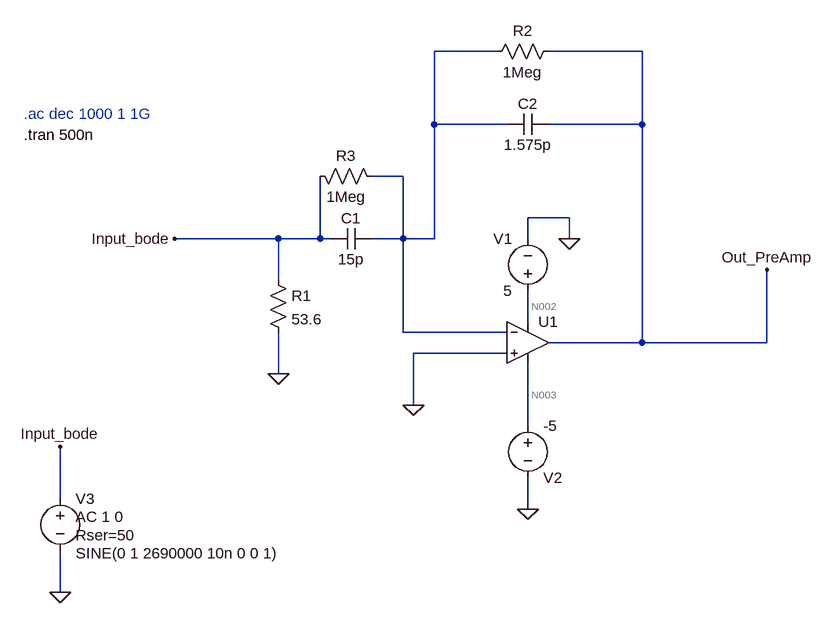
[diagram p0: schematic preamp_v2.asc]
preamp_v2.asc, the LTspice schematic file:
Version 4
SHEET 1 888 796
WIRE 400 -128 304 -128
WIRE 624 -128 480 -128
WIRE 304 -16 304 -128
WIRE 416 -16 304 -16
WIRE 624 -16 624 -128
WIRE 624 -16 480 -16
WIRE 256 64 208 64
WIRE 512 128 448 128
WIRE 64 160 -96 160
WIRE 128 160 128 64
WIRE 128 160 64 160
WIRE 144 160 128 160
WIRE 256 160 256 64
WIRE 256 160 208 160
WIRE 304 160 304 -16
WIRE 304 160 256 160
WIRE 448 160 448 128
WIRE 512 160 512 128
WIRE 64 224 64 160
WIRE 448 288 448 240
WIRE 256 304 256 160
WIRE 416 304 256 304
WIRE 624 320 624 -16
WIRE 624 320 480 320
WIRE 816 320 816 208
WIRE 816 320 624 320
WIRE 416 336 272 336
WIRE 64 368 64 304
WIRE 272 416 272 336
WIRE 448 448 448 352
WIRE -272 560 -272 480
WIRE 448 576 448 528
WIRE -272 704 -272 640
FLAG -272 704 0
FLAG -272 480 Input_bode
FLAG 448 576 0
FLAG 512 160 0
FLAG 272 416 0
FLAG 816 208 Out_PreAmp
FLAG -96 160 Input_bode
FLAG 64 368 0
SYMBOL voltage 448 256 R180
WINDOW 0 24 96 Left 2
WINDOW 3 24 16 Left 2
WINDOW 123 0 0 Left 0
WINDOW 39 0 0 Left 0
SYMATTR InstName V1
SYMATTR Value 5
SYMBOL voltage 448 432 R0
WINDOW 0 24 96 Left 2
WINDOW 3 24 16 Left 2
WINDOW 123 0 0 Left 0
WINDOW 39 0 0 Left 0
SYMATTR InstName V2
SYMATTR Value -5
SYMBOL OpAmps\\UniversalOpAmp1 448 320 R0
SYMATTR InstName U1
SYMATTR Value2 Avol=750 GBW=358Meg Vos=0
SYMBOL voltage -272 544 R0
WINDOW 123 24 44 Left 2
WINDOW 39 24 72 Left 2
WINDOW 3 24 100 Left 2
SYMATTR Value2 AC 1 0
SYMATTR SpiceLine Rser=50
SYMATTR Value SINE(0 1 2690000 10n 0 0 1)
SYMATTR InstName V3
SYMBOL cap 208 144 R90
WINDOW 0 0 32 VBottom 2
WINDOW 3 32 32 VTop 2
SYMATTR InstName C1
SYMATTR Value 15p
SYMBOL cap 480 -32 R90
WINDOW 0 0 32 VBottom 2
WINDOW 3 32 32 VTop 2
SYMATTR InstName C2
SYMATTR Value 1.575p
SYMBOL res 48 208 R0
SYMATTR InstName R1
SYMATTR Value 53.6
SYMBOL res 496 -144 R90
WINDOW 0 0 56 VBottom 2
WINDOW 3 32 56 VTop 2
SYMATTR InstName R2
SYMATTR Value 1Meg
SYMBOL res 112 48 M90
WINDOW 0 0 56 VBottom 2
WINDOW 3 32 56 VTop 2
SYMATTR InstName R3
SYMATTR Value 1Meg
TEXT -328 0 Left 2 !.tran 500n
TEXT -328 -32 Left 2 ;.ac dec 1000 1 1G

The netlist it stands for:
* preamp_v2.asc
V1 N002 0 5
V2 N003 0 -5
XU1 0 N001 N002 N003 Out_PreAmp level1 Avol=750 GBW=358Meg Vos=0 En=0 Enk=0 In=0 Ink=0 Rin=500Meg  ; pins In+ In- V+ V- OUT
V3 Input_bode 0 SINE(0 1 2690000 10n 0 0 1) AC 1 0 Rser=50
C1 N001 Input_bode 15p
C2 Out_PreAmp N001 1.575p
R1 Input_bode 0 53.6
R2 Out_PreAmp N001 1Meg
R3 Input_bode N001 1Meg
.tran 500n
* .ac dec 1000 1 1G
.lib UniversalOpAmp1.lib
.backanno
.end

* Results of the author's LTspice run, read from the files saved beside the schematic
* Operating Point, zero values left out:
*   V(n002) = 5 V
*   V(n003) = -5 V
*   I(V1) = -10 nA
*   I(V2) = 10 nA
*   Ix(u1:3) = 10 nA
*   Ix(u1:4) = -10 nA
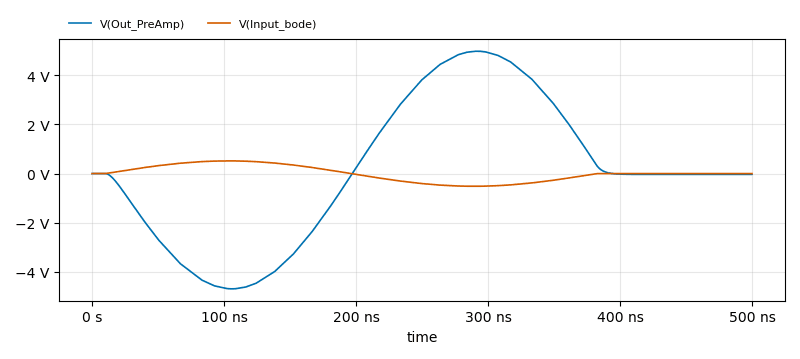
[diagram p1: Transient Analysis of preamp_v2.asc, plotted from the saved traces]
* Transient Analysis, 1 run:
*   V(Out_PreAmp): min -4.697 V, max 4.985 V, average 99.63 mV, rms 2.953 V, last -31.45 mV
*   V(Input_bode): min -516.9 mV, max 517 mV, average 31.28 µV, rms 315.2 mV, last 0 V